# Altium schematic sheet HS-Treiber.SchDoc: HS-Treiber/Messung
size A4; Date: April '16; DrawnBy: Student; DocumentNumber: 2; SheetNumber: 2; SheetTotal: 2
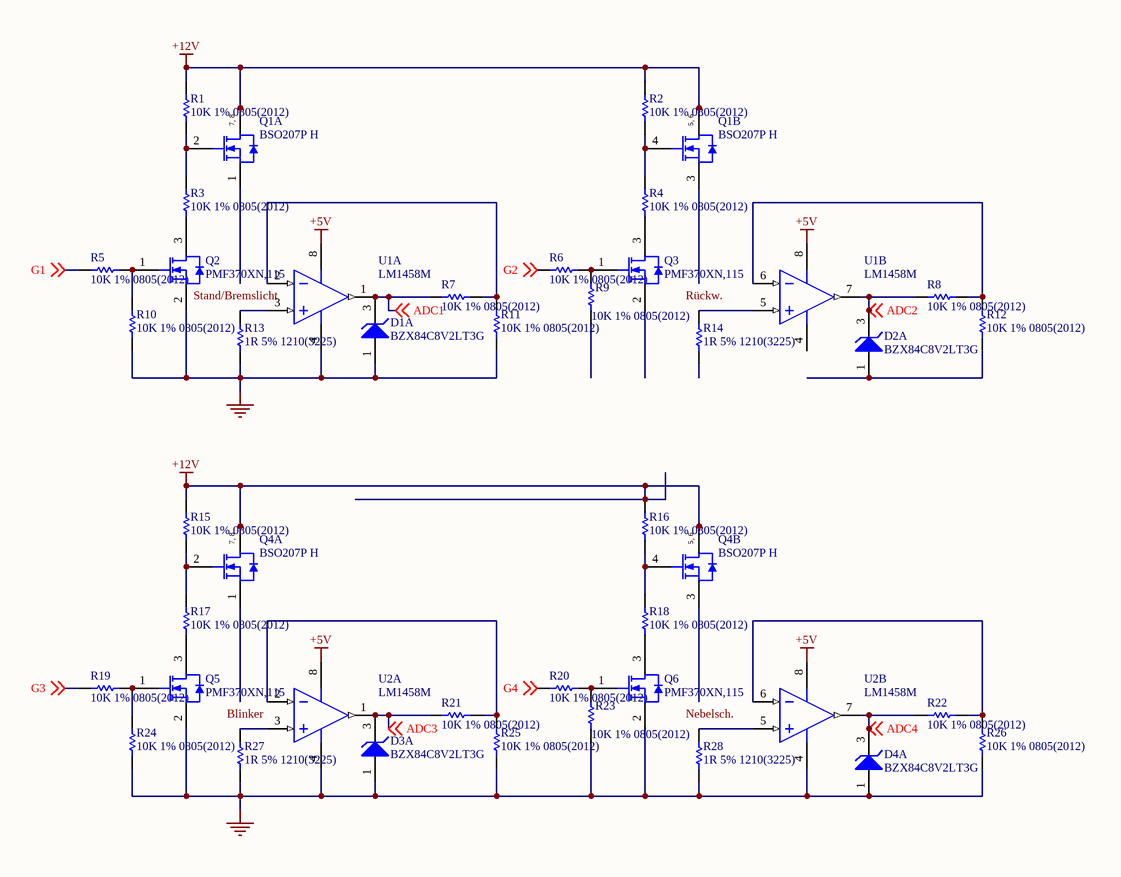
[diagram p0: HS-Treiber.SchDoc]

## Parts
D1  BZX84C8V2LT3G  [ONSC-SOT-23-3-318-08_V]  (part A of 2)
D2  BZX84C8V2LT3G  [ONSC-SOT-23-3-318-08_V]  (part A of 2)
D3  BZX84C8V2LT3G  [ONSC-SOT-23-3-318-08_V]  (part A of 2)
D4  BZX84C8V2LT3G  [ONSC-SOT-23-3-318-08_V]  (part A of 2)
Q1  BSO207P H  [INF-PG-DSO-8-3_L]  (parts A,B of 2)
Q2  PMF370XN,115  [NXP-SOT323_M]
Q3  PMF370XN,115  [NXP-SOT323_M]
Q4  BSO207P H  [INF-PG-DSO-8-3_L]  (parts A,B of 2)
Q5  PMF370XN,115  [NXP-SOT323_M]
Q6  PMF370XN,115  [NXP-SOT323_M]
R1  10K 1% 0805(2012)  [RESC0805(2012)_M]
R2  10K 1% 0805(2012)  [RESC0805(2012)_M]
R3  10K 1% 0805(2012)  [RESC0805(2012)_M]
R4  10K 1% 0805(2012)  [RESC0805(2012)_M]
R5  10K 1% 0805(2012)  [RESC0805(2012)_M]
R6  10K 1% 0805(2012)  [RESC0805(2012)_M]
R7  10K 1% 0805(2012)  [RESC0805(2012)_M]
R8  10K 1% 0805(2012)  [RESC0805(2012)_M]
R9  10K 1% 0805(2012)  [RESC0805(2012)_M]
R10  10K 1% 0805(2012)  [RESC0805(2012)_M]
R11  10K 1% 0805(2012)  [RESC0805(2012)_M]
R12  10K 1% 0805(2012)  [RESC0805(2012)_M]
R13  1R 5% 1210(3225)  [RESC1210(3225)_N]
R14  1R 5% 1210(3225)  [RESC1210(3225)_N]
R15  10K 1% 0805(2012)  [RESC0805(2012)_M]
R16  10K 1% 0805(2012)  [RESC0805(2012)_M]
R17  10K 1% 0805(2012)  [RESC0805(2012)_M]
R18  10K 1% 0805(2012)  [RESC0805(2012)_M]
R19  10K 1% 0805(2012)  [RESC0805(2012)_M]
R20  10K 1% 0805(2012)  [RESC0805(2012)_M]
R21  10K 1% 0805(2012)  [RESC0805(2012)_M]
R22  10K 1% 0805(2012)  [RESC0805(2012)_M]
R23  10K 1% 0805(2012)  [RESC0805(2012)_M]
R24  10K 1% 0805(2012)  [RESC0805(2012)_M]
R25  10K 1% 0805(2012)  [RESC0805(2012)_M]
R26  10K 1% 0805(2012)  [RESC0805(2012)_M]
R27  1R 5% 1210(3225)  [RESC1210(3225)_N]
R28  1R 5% 1210(3225)  [RESC1210(3225)_N]
U1  LM1458M  [M08A_L]  (parts A,B of 2)
U2  LM1458M  [M08A_L]  (parts A,B of 2)

## Nets
+5V: U1.8(V+) U2.8(V+)
+12V: Q1.5(D2) Q1.6(D2) Q1.7(D1) Q1.8(D1) Q4.5(D2) Q4.6(D2) Q4.7(D1) Q4.8(D1) R1.1 R2.1 R15.1 R16.1
GND: D1.1(A) D3.1(A) D4.1(A) Q2.2(S) Q5.2(S) Q6.2(S) R10.2 R11.2 R13.2 R23.2 R24.2 R25.2 R26.2 R27.2 R28.2 U1.4(V-) U2.4(V-)
ADC1: D1.3(K) R7.1 U1.1(OUTA) ; off-sheet ADC1
ADC2: D2.3(K) R8.2 U1.7(OUTB) ; off-sheet ADC2
ADC3: D3.3(K) R21.1 U2.1(OUTA) ; off-sheet ADC3
ADC4: D4.3(K) R22.2 U2.7(OUTB) ; off-sheet ADC4
G1: R5.2 ; off-sheet G1
G2: R6.2 ; off-sheet G2
G3: R19.2 ; off-sheet G3
G4: R20.2 ; off-sheet G4
NetD2_1: D2.1(A) R12.2
NetQ1_2: Q1.2(G1) R1.2 R3.1
NetQ1_4: Q1.4(G2) R2.2 R4.1
NetQ2_1: Q2.1(G) R5.1 R10.1
NetQ2_3: Q2.3(D) R3.2
NetQ3_1: Q3.1(G) R6.1 R9.1
NetQ3_3: Q3.3(D) R4.2
NetQ4_2: Q4.2(G1) R15.2 R17.1
NetQ4_4: Q4.4(G2) R16.2 R18.1
NetQ5_1: Q5.1(G) R19.1 R24.1
NetQ5_3: Q5.3(D) R17.2
NetQ6_1: Q6.1(G) R20.1 R23.1
NetQ6_3: Q6.3(D) R18.2
NetR7_2: R7.2 R11.1 U1.2(INA-)
NetR8_1: R8.1 R12.1 U1.6(INB-)
NetR13_1: R13.1 U1.3(INA+)
NetR14_1: R14.1 U1.5(INB+)
NetR21_2: R21.2 R25.1 U2.2(INA-)
NetR22_1: R22.1 R26.1 U2.6(INB-)
NetR27_1: R27.1 U2.3(INA+)
NetR28_1: R28.1 U2.5(INB+)

Not connected (* = marked no-connect by the designer): Q1 1(S1) 3(S2); Q3 2(S); Q4 1(S1) 3(S2); R9 2; R14 2

## Notes on the sheet
- Stand/Bremslicht
- (near R14) Rückw.
- Blinker
- (near R28) Nebelsch.
- Datum:
- Blatt
- von
- Rev.:
- Grösse:
- A4
- Datei:
- (in symbol CMP-1099-00011-1, part A) 7, 8
- (in symbol CMP-1099-00011-1, part B) 5, 6

## Library data of the parts
D1-D4 = CMP-1060-01015-1: Zener Voltage Regulator, 225 mW, 3-Pin SOT-23, Pb-Free, Tape and Reel; Manufacturer: On Semiconductor; ComponentLink1Description: Manufacturer URL; PackageReference: SOT-23-3-318-08; ComponentLink3URL: http://www.onsemi.cn/pub_link/Collateral/318-08.PDF; Mounting Technology: Surface Mount; PackageDescription: 3-Pin Small Outline Transistor, Body 2.92 x 1.3 mm, Pitch 0.95 mm; PartNumber: BZX84C8V2LT3G; DatasheetVersion: Rev. 17; RoHS: Pb-Free; ComponentLink3Description: Package Specification; ComponentLink2Description: Datasheet; ComponentLink1URL: http://www.onsemi.com/; Packing: Tape and Reel; ComponentLink2URL: http://www.onsemi.com/pub_link/Collateral/BZX84C2V4LT1-D.PDF; PackageVersion: Rev. AP, 11/2009; PartId: 1
Q1 Q4 = CMP-1099-00011-1: P-Channel OptiMOS P Power-Transistor, -20 V VDS, -5.7 A ID, -55 to 150 degC, PG-DSO-8-3, Reel, Green; Manufacturer: Infineon; VGS(th) (max): -1.2Â V; IDpuls (max): -22.8Â A; Pto t (max): 1.6Â W; Rth: 110Â K/W; RDS (on) (max) (@4.5V): 45Â mOhm; RDS (on) (max) (@2.5V): 70Â mOhm; QG: -12Â nC; ID (max): -5.7Â A; Green: TRUE; VDS (max): -20Â V; VGS(th) (min): -0.6Â V; Mounting Technology: Surface Mount; PartNumber: BSO207P H; PackageReference: PG-DSO-8-3; ComponentLink1URL: http://www.infineon.com/; ComponentLink2URL: http://www.infineon.com/dgdl/BSO207P_H_1+3.pdf?folderId=db3a304314dca38901154a7313d21a66&fileId=db3a304326c2768b0126d138507b685e; Packing: Reel; ComponentLink1Description: Manufacturer URL; ComponentLink3Description: Package Specification; Halogen-free: TRUE; ComponentLink2Description: Datasheet; DatasheetVersion: Rev. 1.3; PackageDescription: 8-Pin Plastic (Green) Dual Small Outline Package, 4.9 x 3.9 mm Body, 1.27 mm Pitch; RDS (on) (max): 70Â mOhm; ComponentLink3URL: http://www.infineon.com/cms/packages/SMD_-_Surface_Mounted_Devices/P-PG-DSO/P-PG-DSO-08-03x_-6x_-7x_-8x_-10x_-13x_-15x_-18x_-19x_-20x_-23.html?__locale=en; PartId: 1
Q2 Q3 Q5 Q6 = CMP-1258-00167-1: N-Channel TrenchMOS Extremely Low Level FET, 30 V, 0.87 A, 3-Pin SOT323, Tape and Reel; Manufacturer: NXP Semiconductors; VDS [max] (V): 30; VGSth [typ] (V): 1; Packing: Tape & Reel; Channel Type: N; Ciss [typ] (pF): 37; ID [max] (A): 0.87; Coss [typ] (pF): 8.5; Code_JEITA: SC-70; ComponentLink3URL: http://www.nxp.com/documents/outline_drawing/sot323_po.pdf; ComponentLink1URL: http://www.nxp.com/; Mounting Technology: Surface Mount; ComponentLink2URL: http://www.nxp.com/documents/data_sheet/PMF370XN.pdf; DatasheetVersion: Rev. 03; PackageReference: SOT323; ComponentLink1Description: Manufacturer URL; ComponentLink2Description: Datasheet; PackageDescription: 3-Pin Small Outline Transistor Package, Body 2 x 1.25 mm, Pitch 0.65 mm; PartNumber: PMF370XN,115; ComponentLink3Description: Package Specification; PackageVersion: 06-03-16, 03/2006
R1-R12 R15-R26 = CMP-1013-00623-1: 10K 0.125W 1% 0805 (2012 Metric)  SMD; Value: 10000.00 Ohm; Case-Metric: 2012; Case-EIA: 0805; Tolerance: 1 %; Power: 0.125 W; Technology: SMT
R13 R14 R27 R28 = CMP-1015-00002-1: 1R 0.5W 5% 1210 (3225 Metric)  SMD; Case-EIA: 1210; Value: 1.00 Ohm; Case-Metric: 3225; Power: 0.5 W; Technology: SMT; Tolerance: 5 %
U1 U2 = CMP-0055-00685-2: Dual Operational Amplifier, 8-pin Narrow SOIC; Manufacturer: National Semiconductor; CompType: Amplifiers; PackageTopMarking: NSZXTT*LM*1458M; PowerWise: N; PackageDescription: SOIC Narrow, 4.9 x 3.9 x 1.45mm, 8 Lead, 1.27mm Pitch; ComponentLink1Description: LM1458 Datasheet; RoHS: N; Code_IPC: SOIC127P600-8; ComponentLink2Description: LM1458 Web Page; ComponentLink1URL: http://www.national.com/ds/LM/LM1458.pdf; PackageVersion: revM, May-2009; RevisionNote: Component URLs added; PinCount: 8; Code_JEDEC: MS-012-AA; ComponentLink3URL: http://www.national.com/packaging/folders/m08a.html; DatasheetVersion: Aug-2003; ComponentLink2URL: http://www.national.com/pf/LM/LM1458.html; PackageReference: M08A; ComponentLink3Description: M08A Package Page; PartId: 1